# EAGLE design sphere_robo (EAGLE 8.2.2)
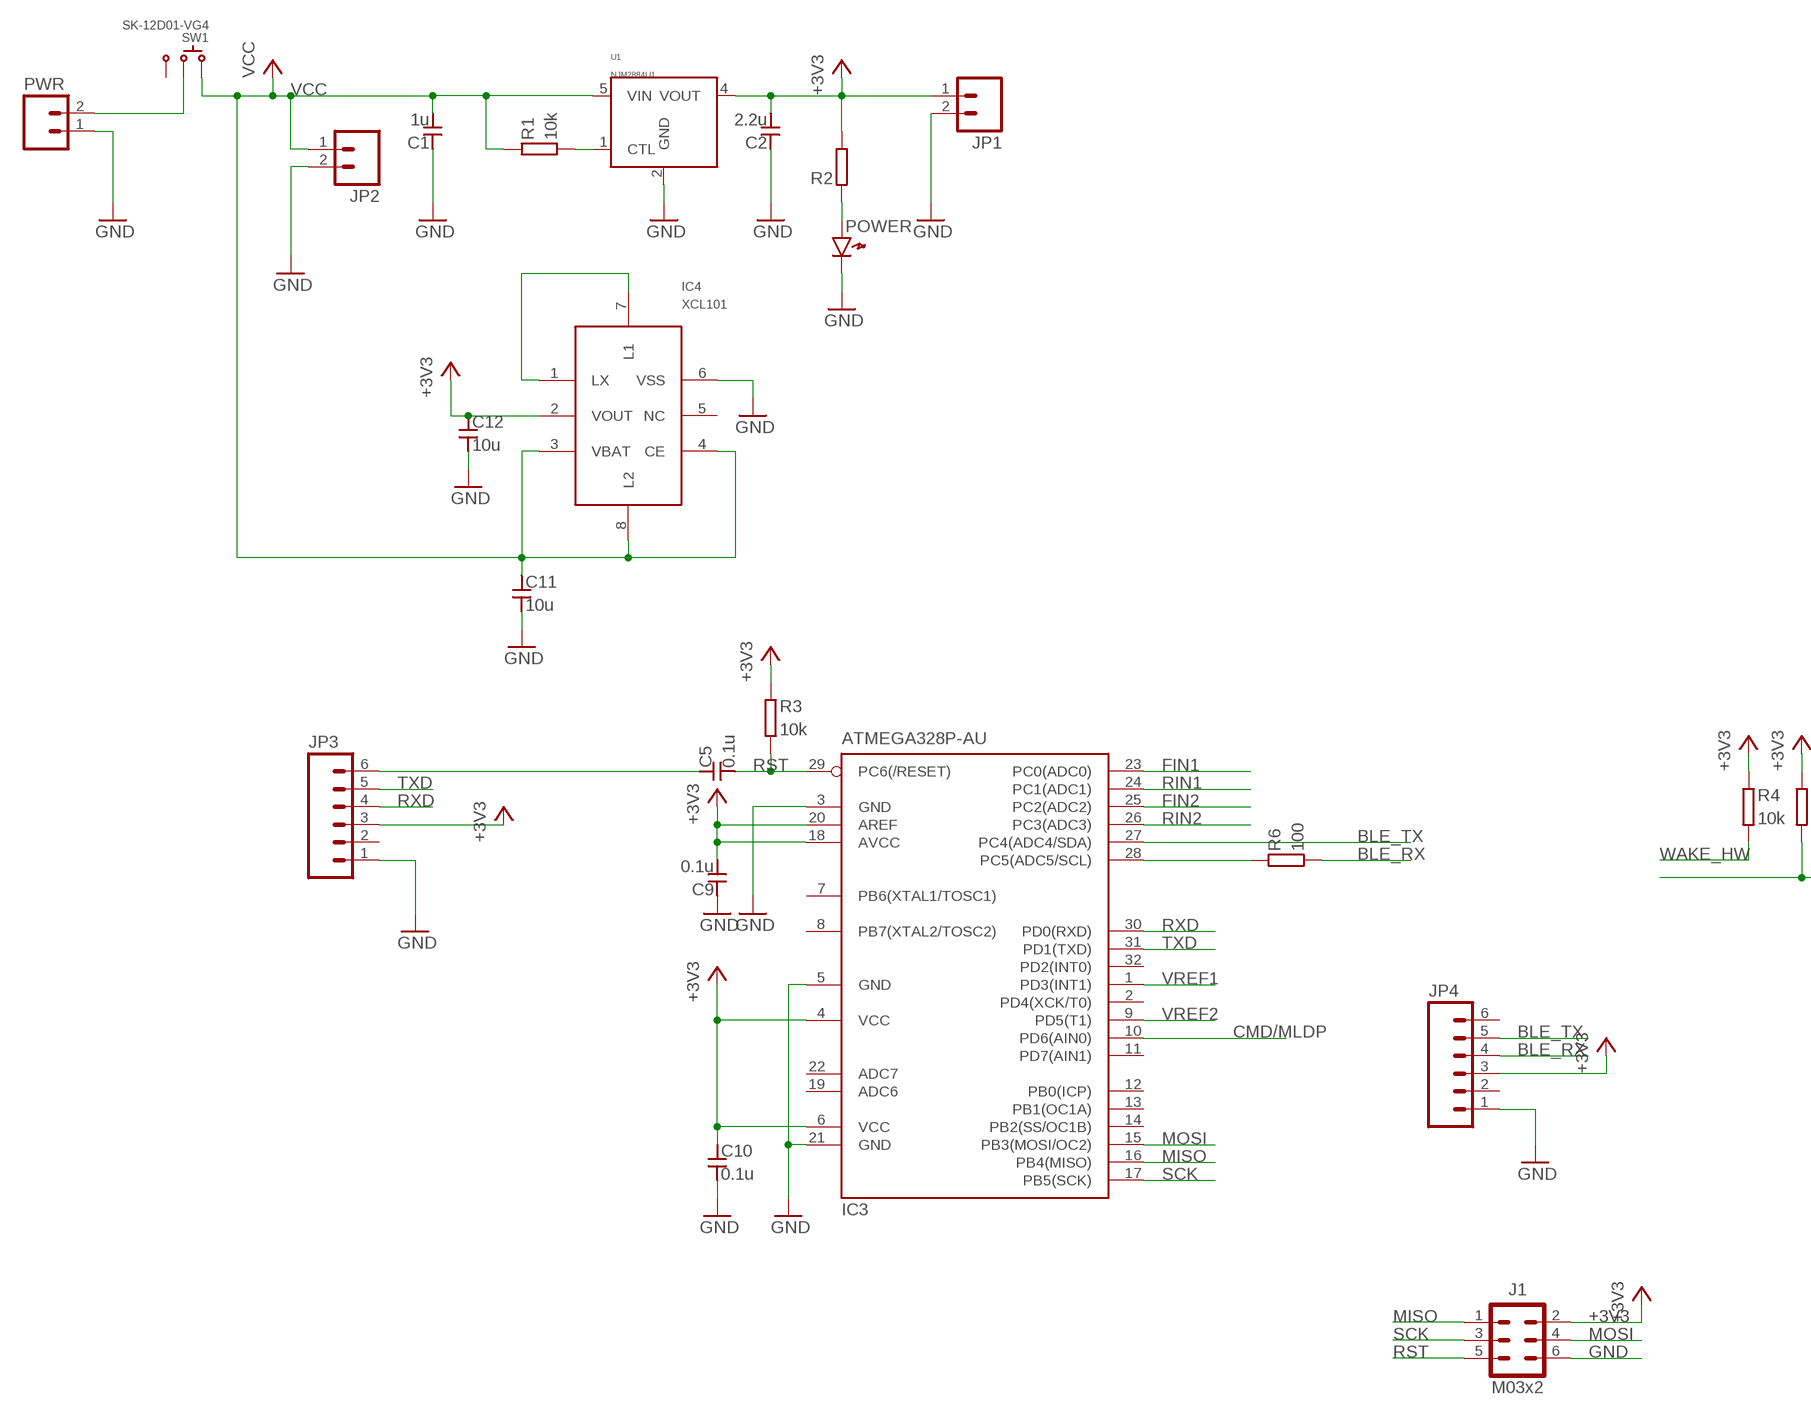
[diagram p0: schematic, sheet 1, part 1 of 2]
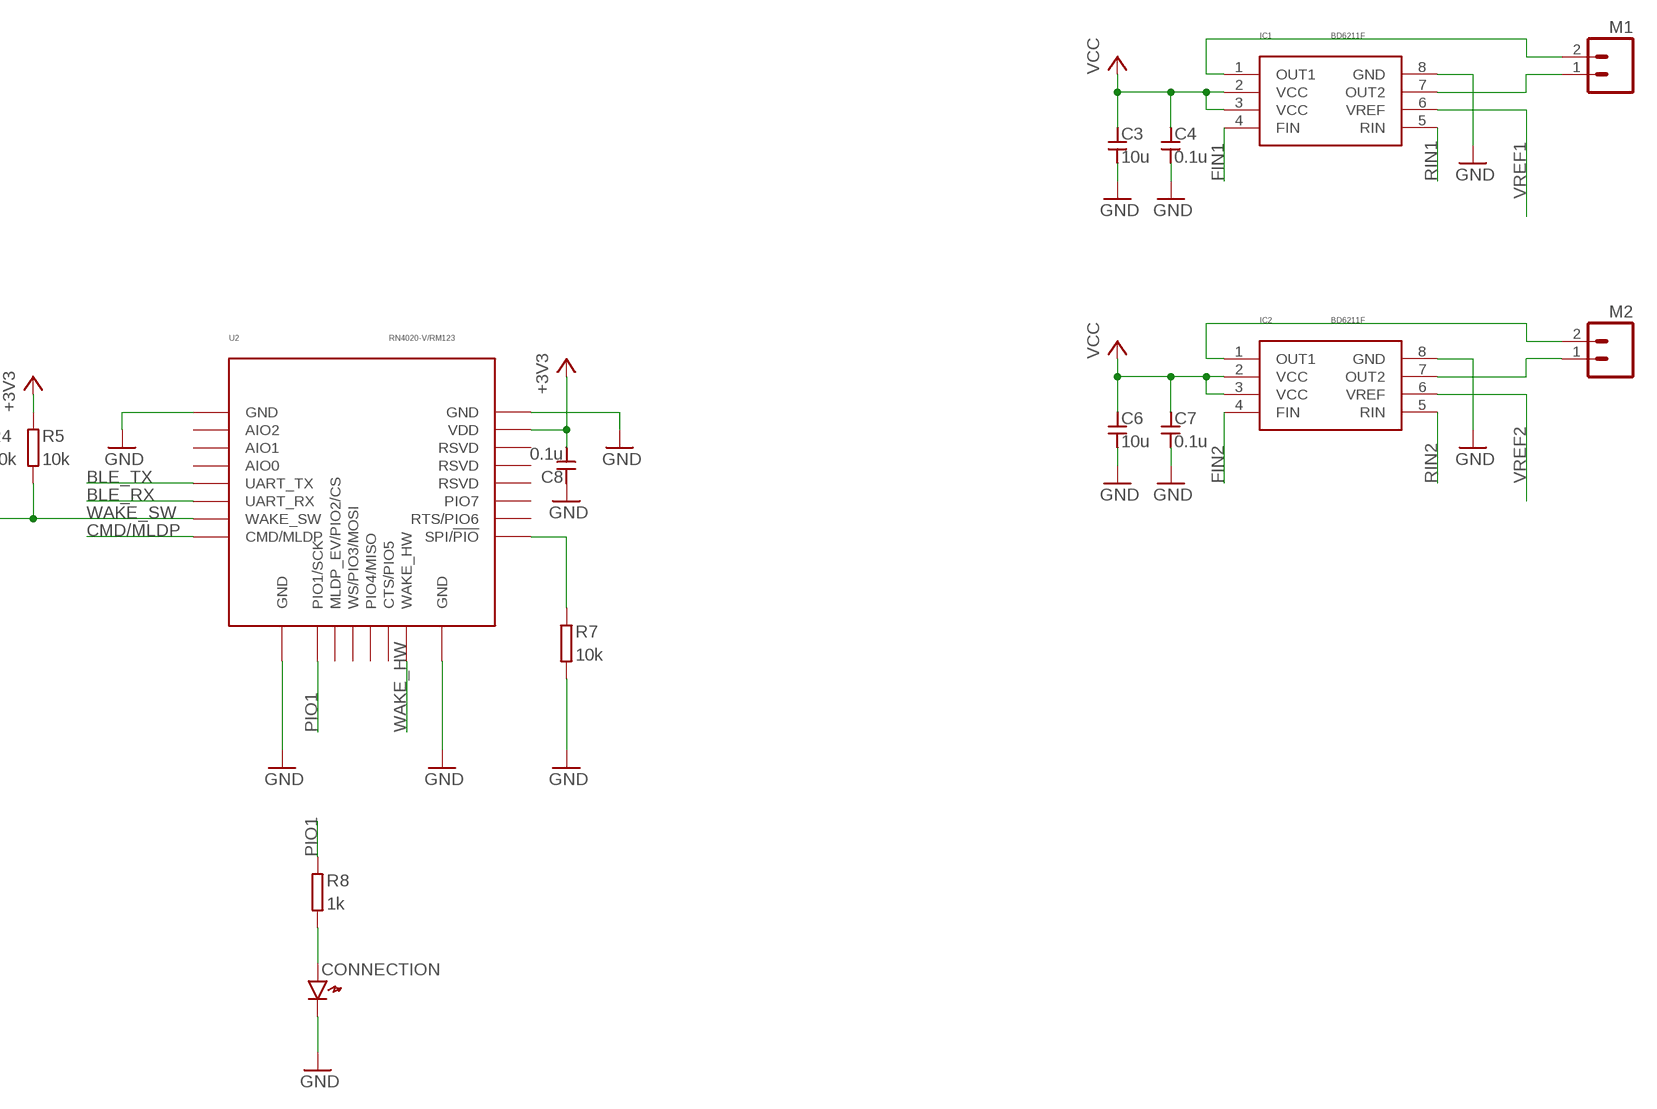
[diagram p1: schematic, sheet 1, part 2 of 2]

## Parts
C1  1u  CAPACITOR1608_REDUCED  [SMD1608_REDUCED]
C2  2.2u  CAPACITOR1608_REDUCED  [SMD1608_REDUCED]
C3  10u  CAPACITOR2012_REDUCED  [SMD2012_REDUCED]
C4  0.1u  CAPACITOR1608_REDUCED  [SMD1608_REDUCED]
C5  0.1u  CAPACITOR1608_REDUCED  [SMD1608_REDUCED]
C6  10u  CAPACITOR2012_REDUCED  [SMD2012_REDUCED]
C7  0.1u  CAPACITOR1608_REDUCED  [SMD1608_REDUCED]
C8  0.1u  CAPACITOR1608_REDUCED  [SMD1608_REDUCED]
C9  0.1u  CAPACITOR1608_REDUCED  [SMD1608_REDUCED]
C10  0.1u  CAPACITOR1608_REDUCED  [SMD1608_REDUCED]
C11  10u  CAPACITOR2012_REDUCED  [SMD2012_REDUCED]
C12  10u  CAPACITOR2012_REDUCED  [SMD2012_REDUCED]
CONNECTION  LED1608_REDUCED  [LED1608_REDUCED]
IC1  BD6211F  [SOP-8]
IC2  BD6211F  [SOP-8]
IC3  ATMEGA328P-AU  [TQFP32-08]
IC4  XCL101  [CL-2025]
J1  M03X2STD  [2X03]
JP1  M02NOSILK  [1X02-NOSILK]
JP2  M02NOSILK  [1X02-NOSILK]
JP3  M06NOSILK  [1X06-NOSILK]
JP4  M06NOSILK  [1X06-NOSILK]
M1  M02NOSILK  [1X02-NOSILK]
M2  M02NOSILK  [1X02-NOSILK]
POWER  LED1608_REDUCED  [LED1608_REDUCED]
PWR  M02NOSILK  [1X02-NOSILK]
R1  10k  RESISTOR1608_REDUCED  [SMD1608_REDUCED]
R2  RESISTOR1608_REDUCED  [SMD1608_REDUCED]
R3  10k  RESISTOR1608_REDUCED  [SMD1608_REDUCED]
R4  10k  RESISTOR1608_REDUCED  [SMD1608_REDUCED]
R5  10k  RESISTOR1608_REDUCED  [SMD1608_REDUCED]
R6  100  RESISTOR1608_REDUCED  [SMD1608_REDUCED]
R7  10k  RESISTOR1608_REDUCED  [SMD1608_REDUCED]
R8  1k  RESISTOR1608_REDUCED  [SMD1608_REDUCED]
SW1  SK-12D01-VG4  [SK-12D01-VG4]
U1  NJM2884U1  [SOT-89-5]
U2  RN4020-V/RM123  [RN4020]

## Nets
+3V3: C2.2 C8.2 C9.2 C10.1 C12.1 IC3.4(VCC) IC3.6(VCC) IC3.18(AVCC) IC3.20(AREF) IC4.2(VOUT) J1.2 JP1.1 JP3.3 JP4.3 R2.2 R3.1 R4.1 R5.1 U1.4(VOUT) U2.23(VDD)
BLE_RX: JP4.4 R6.2 U2.6(UART_RX)
BLE_TX: IC3.27(PC4(ADC4/SDA)) JP4.5 U2.5(UART_TX)
CMD/MLDP: IC3.10(PD6(AIN0)) U2.8(CMD/MLDP)
FIN1: IC1.4(FIN) IC3.23(PC0(ADC0))
FIN2: IC2.4(FIN) IC3.25(PC2(ADC2))
GND: C1.1 C2.1 C3.2 C4.2 C6.2 C7.2 C8.1 C9.1 C10.2 C11.2 C12.2 CONNECTION.K IC1.8(GND) IC2.8(GND) IC3.3(GND) IC3.5(GND) IC3.21(GND) IC4.6(VSS) J1.6 JP1.2 JP2.2 JP3.1 JP4.1 POWER.K PWR.1 R7.2 U1.2(GND) U2.1(GND) U2.9(GND) U2.16(GND) U2.24(GND)
MISO: IC3.16(PB4(MISO)) J1.1
MOSI: IC3.15(PB3(MOSI/OC2)) J1.4
N$2: C5.1 JP3.6
N$3: CONNECTION.A R8.2
N$7: IC3.28(PC5(ADC5/SCL)) R6.1
N$11: R7.1 U2.17(SPI/!PIO)
N$13: PWR.2 SW1.2
N$18: R1.2 U1.1(CTL)
N$20: IC4.1(LX) IC4.7(L1)
N$31: POWER.A R2.1
N$37: IC2.1(OUT1) M2.2
N$38: IC2.7(OUT2) M2.1
N$39: IC1.1(OUT1) M1.2
N$40: IC1.7(OUT2) M1.1
PIO1: R8.1 U2.10(PIO1/SCK)
RIN1: IC1.5(RIN) IC3.24(PC1(ADC1))
RIN2: IC2.5(RIN) IC3.26(PC3(ADC3))
RST: C5.2 IC3.29(PC6(/RESET)) J1.5 R3.2
RXD: IC3.30(PD0(RXD)) JP3.4
SCK: IC3.17(PB5(SCK)) J1.3
TXD: IC3.31(PD1(TXD)) JP3.5
VCC: C1.2 C3.1 C4.1 C6.1 C7.1 C11.1 IC1.2(VCC) IC1.3(VCC) IC2.2(VCC) IC2.3(VCC) IC4.3(VBAT) IC4.4(CE) IC4.8(L2) JP2.1 R1.1 SW1.1 U1.5(VIN)
VREF1: IC1.6(VREF) IC3.1(PD3(INT1))
VREF2: IC2.6(VREF) IC3.9(PD5(T1))
WAKE_HW: R4.2 U2.15(WAKE_HW)
WAKE_SW: R5.2 U2.7(WAKE_SW)
Unconnected: IC3.2(PD4(XCK/T0)) IC3.7(PB6(XTAL1/TOSC1)) IC3.8(PB7(XTAL2/TOSC2)) IC3.11(PD7(AIN1)) IC3.12(PB0(ICP)) IC3.13(PB1(OC1A)) IC3.14(PB2(SS/OC1B)) IC3.19(ADC6) IC3.22(ADC7) IC3.32(PD2(INT0)) IC4.5(NC) JP3.2 JP4.2 JP4.6 SW1.3 U2.2(AIO2) U2.3(AIO1) U2.4(AIO0) U2.11(MLDP_EV/PIO2/CS) U2.12(WS/PIO3/MOSI) U2.13(PIO4/MISO) U2.14(CTS/PIO5) U2.18(RTS/PIO6) U2.19(PIO7) U2.20(RSVD) U2.21(RSVD) U2.22(RSVD)

## Library data of the parts
C1-C12 = generic:CAPACITOR: Generic Capacitor
CONNECTION POWER = generic:LED: Generic LEDs
IC1 IC2 = motor_driver:BD6211: ROHM Motor driver
IC3 = AVR:ATMEGA328P-AU: AVR ATMEGA328P-AU AKIZUKI CODE I-04386
IC4 = DCDC:XCL101
J1 = header:M03X2
JP1 JP2 M1 M2 PWR = header:M02
JP3 JP4 = header:M06
R1-R8 = generic:RESISTOR: Generic Registor
SW1 = switch:SK-12D01-VG4: Slide switch ON-(ON) akizuki: P-08789
U1 = LDO:NJM2884U1: JRC LDO Io(max ) = 500mA akizuki : I-10896
U2 = com_module:RN4020: Bluetooth Low Energy Module Microchip

## Board
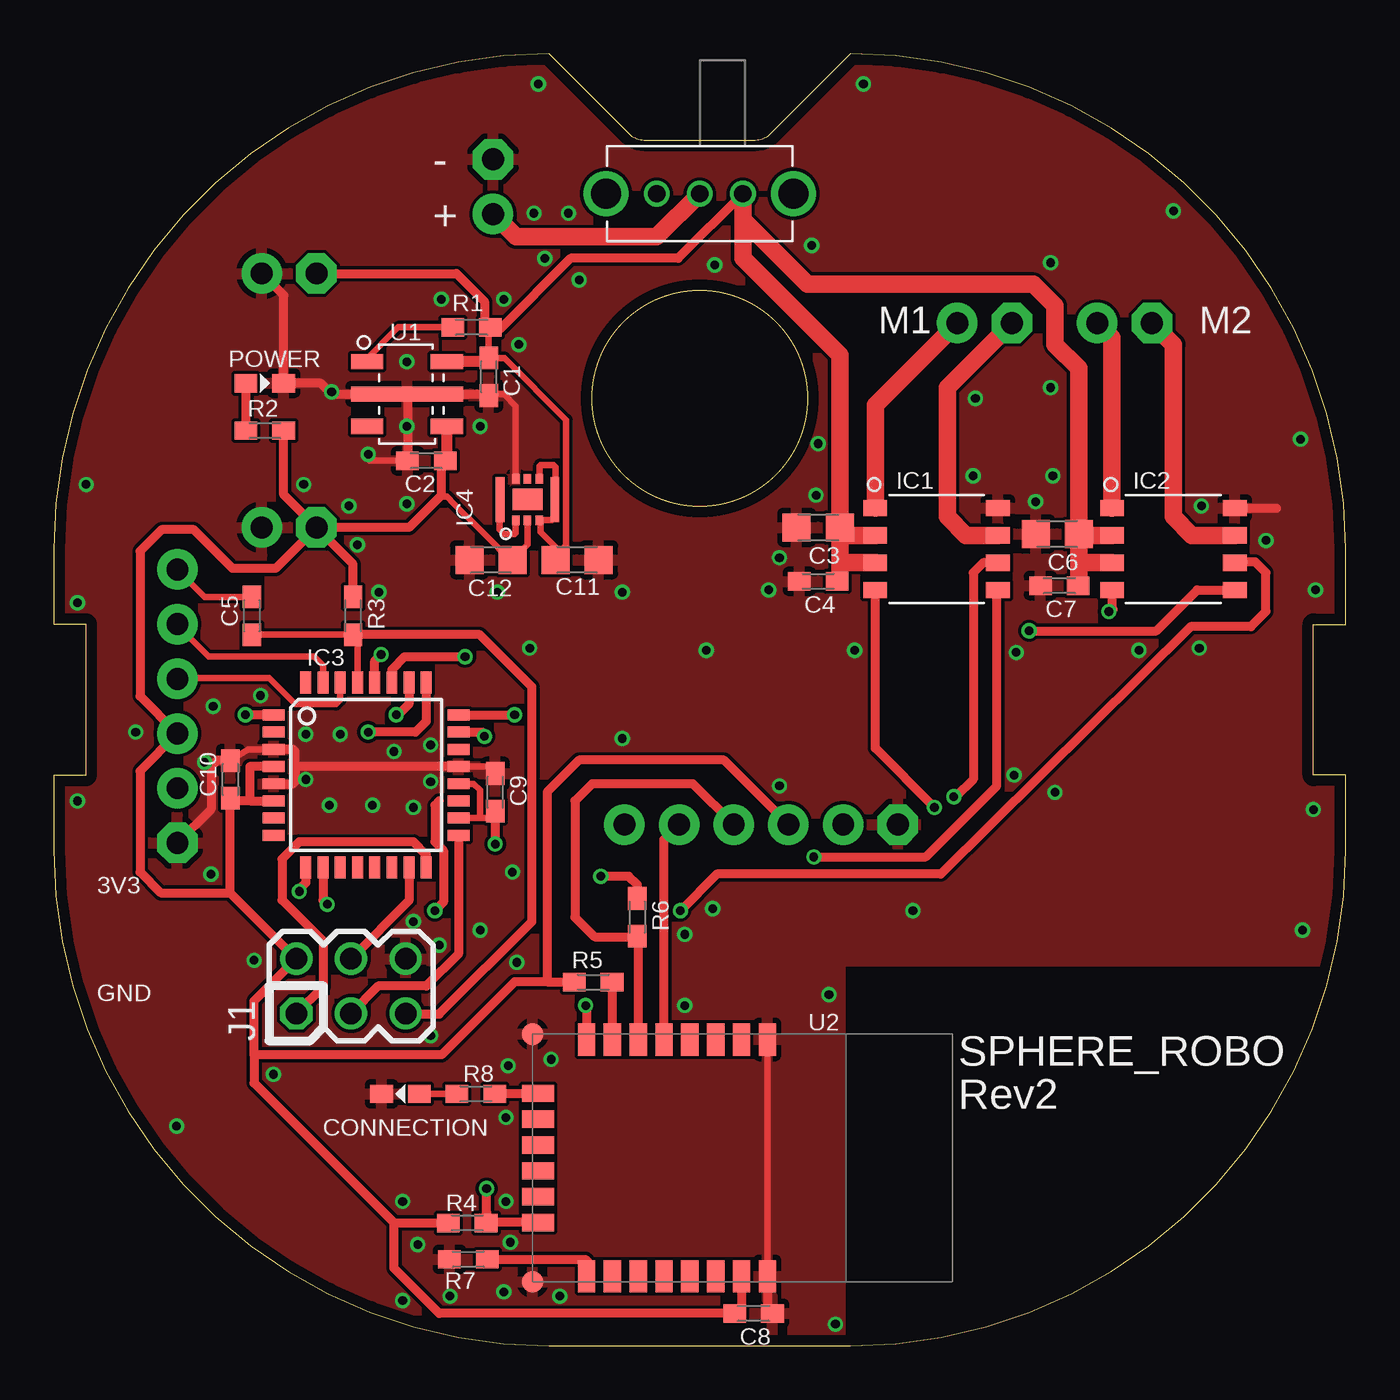
[diagram p2: board, top side]
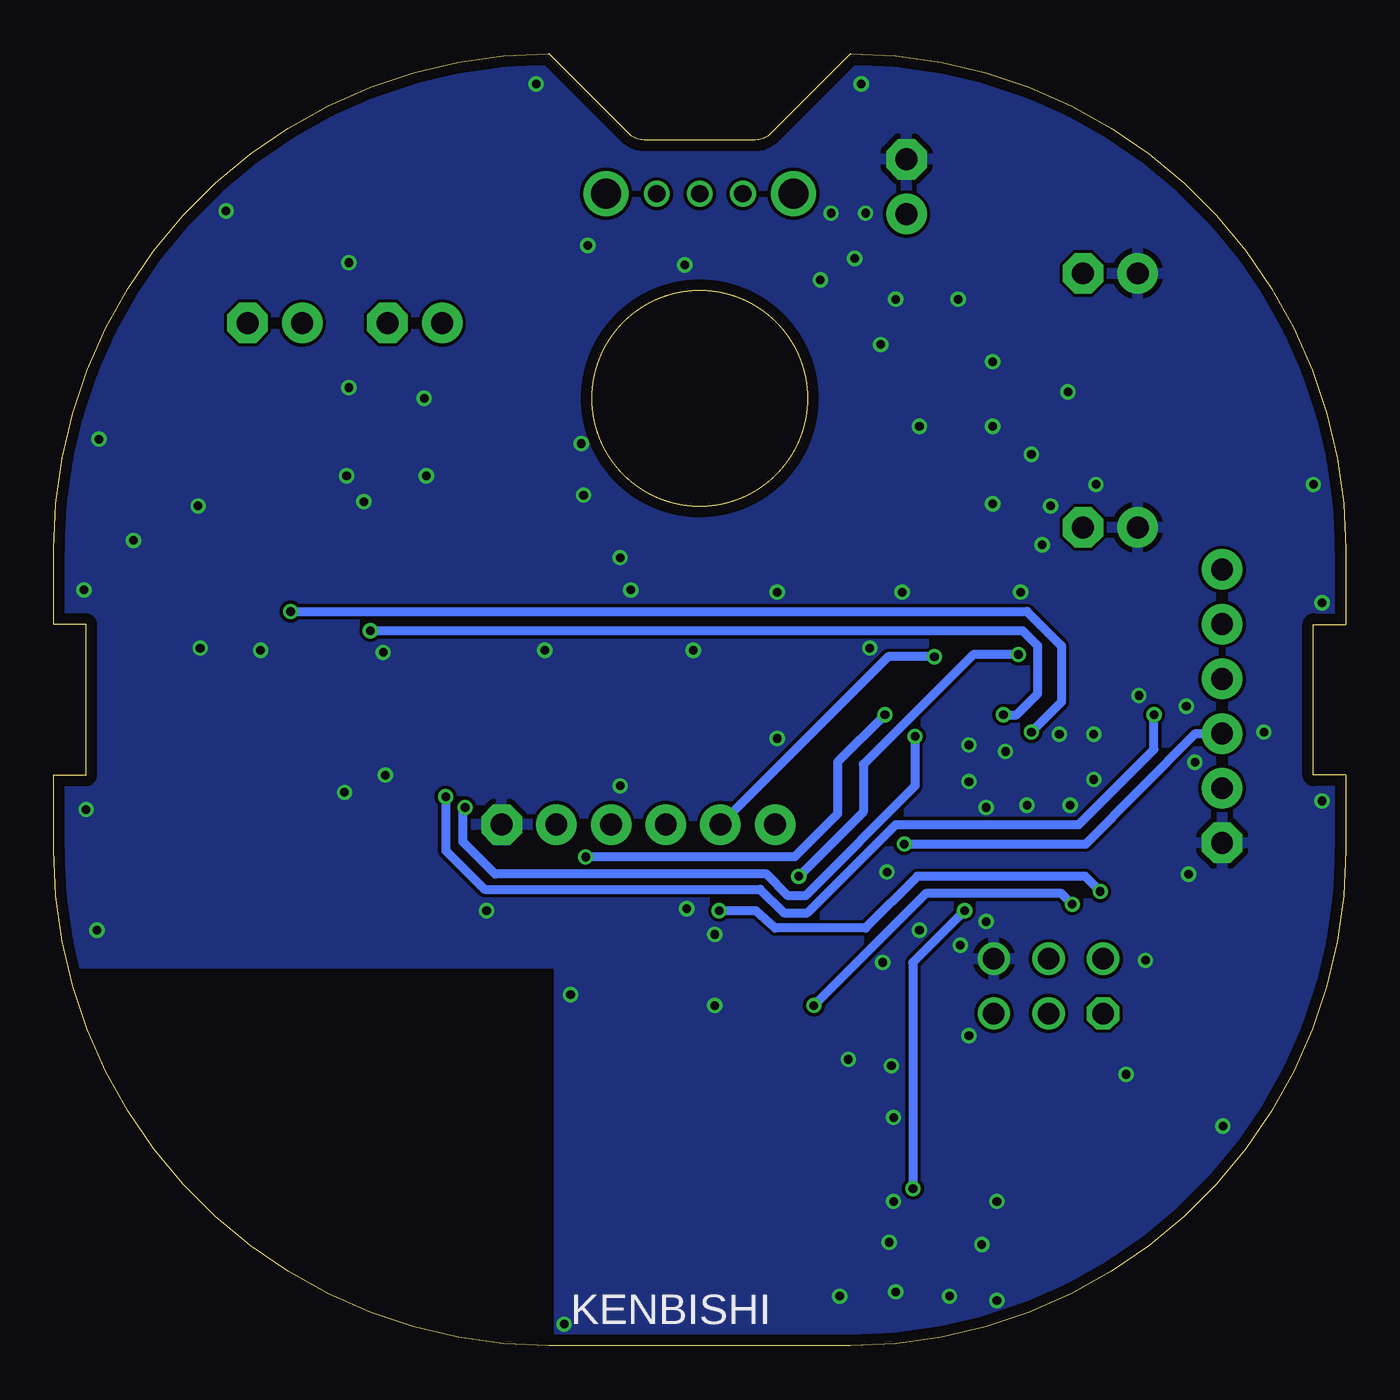
[diagram p3: board, bottom side, seen from below]

Size 60 x 60 mm. Coordinates in mm from the lower left corner, seen from the top.
Outline: 0,26.5 0,23 arc90 23,0 37,0 arc90 60,23 60,26.5 58.5,26.5 58.5,33.5 60,33.5 60,37 arc90 37,60 33.29,56.29 arc-45 32.59,56 27.41,56 arc-45 26.71,56.29 23,60 arc90 0,37 0,33.5 1.5,33.5 1.5,26.5 0,26.5
Outline: circle at 30,44 radius 5
Copper layers (1*16): Top 0.035mm / dielectric 1.6mm / Bottom 0.035mm
Design rules "Elecrow_2-layer_PCB_eagle_rule": minimum track width 6mil, minimum drill 12mil, track to track 6mil, track to pad 6mil, pad to pad 6mil, via to via 8mil, smd to smd 0mil, copper to edge 20mil, drill to drill 10mil, minimum pad ring 6mil, minimum via ring 6mil, stop-mask expansion 0mil, vias tented up to drill 100mil, thermal gap 10mil
tRestrict: area 36.8,0 to 60.8,15.1; area 36.8,14.6 to 60.5,17.6; area 17.9,46.1 to 18,46.8; area 40.3,23.6 to 40.5,24.6
bRestrict: area 36.8,0 to 60.7,15.1; area 36.8,14.7 to 60.4,17.5; area 38.9,23 to 39.6,23.2

### Footprints (pad centres in the part's own frame; a part is rotated, then mirrored left to right if it is on the bottom)
SMD1608_REDUCED = smd 1.05 x 0.85: 1 -0.875,0; 2 0.875,0
SMD2012_REDUCED = smd 1.3 x 1.3: 1 -1,0; 2 1,0
LED1608_REDUCED = smd 1.05 x 0.85: A -0.875,0; K 0.875,0
SOP-8 = smd 1.1 x 0.76: 1 -2.85,1.905; 2 -2.85,0.635; 3 -2.85,-0.635; 4 -2.85,-1.905; 5 2.85,-1.905; 6 2.85,-0.635; 7 2.85,0.635; 8 2.85,1.905
TQFP32-08 = smd 1.016 x 0.508: 1 -4.293,2.8; 2 -4.293,2; 3 -4.293,1.2; 4 -4.293,0.4; 5 -4.293,-0.4; 6 -4.293,-1.2; 7 -4.293,-2; 8 -4.293,-2.8; 17 4.293,-2.8; 18 4.293,-2; 19 4.293,-1.2; 20 4.293,-0.4; 21 4.293,0.4; 22 4.293,1.2; 23 4.293,2; 24 4.293,2.8 | smd 0.508 x 1.016: 9 -2.8,-4.293; 10 -2,-4.293; 11 -1.2,-4.293; 12 -0.4,-4.293; 13 0.4,-4.293; 14 1.2,-4.293; 15 2,-4.293; 16 2.8,-4.293; 25 2.8,4.293; 26 2,4.293; 27 1.2,4.293; 28 0.4,4.293; 29 -0.4,4.293; 30 -1.2,4.293; 31 -2,4.293; 32 -2.8,4.293
CL-2025 = smd 0.35 x 0.44: 1 -0.55,-0.96; 2 0,-0.96; 3 0.55,-0.96; 4 0.55,0.96; 5 0,0.96; 6 -0.55,0.96 | smd 0.4 x 2.1: 7 -1.275,0; 8 1.275,0 | smd 1.4 x 1: P$1 0,0
2X03 = drill 1 octagon: 1 -1.27,2.54 | drill 1: 2 1.27,2.54; 3 -1.27,0; 4 1.27,0; 5 -1.27,-2.54; 6 1.27,-2.54
1X02-NOSILK = drill 1.016 pad 1.88 octagon: 1 0,0 | drill 1.016 pad 1.88: 2 2.54,0
1X06-NOSILK = drill 1.016 pad 1.88 octagon: 1 0,0 | drill 1.016 pad 1.88: 2 2.54,0; 3 5.08,0; 4 7.62,0; 5 10.16,0; 6 12.7,0
SK-12D01-VG4 = drill 0.8: 1 -2,0; 2 0,0; 3 2,0 | drill 1.4: 4 4.35,0; 5 -4.35,0
SOT-89-5 = smd 0.7 x 1.5: 1 -1.5,-1.85; 3 1.5,-1.85; 4 1.5,1.85; 5 -1.5,1.85 | smd 0.7 x 5.2: 2 0,0
RN4020 = smd 1.5 x 0.8: 1 0.25,10.9; 2 0.25,9.7; 3 0.25,8.5; 4 0.25,7.3; 5 0.25,6.1; 6 0.25,4.9; 7 0.25,3.7; 8 0.25,2.5; 17 11.25,2.5; 18 11.25,3.7; 19 11.25,4.9; 20 11.25,6.1; 21 11.25,7.3; 22 11.25,8.5; 23 11.25,9.7; 24 11.25,10.9 | smd 1 x 1: 9 0,0; 16 11.5,0 | smd 0.8 x 1.5: 10 2.75,0.25; 11 3.95,0.25; 12 5.15,0.25; 13 6.35,0.25; 14 7.55,0.25; 15 8.75,0.25

### Placement (x,y rotation side)
C1  20.2,45 90 top
C2  17.3,41.1 0 top
C3  35.5,38 180 top
C4  35.5,35.5 180 top
C5  9.2,33.9 270 top
C6  46.6,37.7 180 top
C7  46.7,35.3 180 top
C8  32.5,1.5 180 top
C9  20.5,25.7 270 top
C10  8.2,26.3 90 top
C11  24.3,36.5 0 top
C12  20.3,36.5 180 top
CONNECTION  16.1,11.7 180 top
IC1  41,37 0 top
IC2  52,37 0 top
IC3  14.5,26.5 0 top
IC4  22,39.3 0 top
J1  13.8,16.7 90 top
JP1  12.2,38 180 top
JP2  12.2,49.8 180 top
JP3  5.74,23.35 90 top
JP4  39.2,24.2 180 top
M1  44.5,47.5 180 top
M2  51,47.5 180 top
POWER  9.8,44.7 0 top
PWR  20.4,55.1 270 top
R1  19.4,47.3 180 top
R2  9.8,42.5 0 top
R3  13.9,33.9 270 top
R4  19.2,5.7 0 top
R5  25.05,16.88 0 top
R6  27.1,19.9 270 top
R7  19.25,4.01 180 top
R8  19.6,11.7 180 top
SW1  30,53.5 180 top
U1  16.4,44.2 270 top
U2  22.24,14.47 270 top

### Tracks (layer width: path | path; a pad name or v marks a point on that pad's centre or on a via)
+3V3  (via drill 0.4)
  Top 0.305: 19.79,24.5 20.27,24.5 20.48,24.71 | 19.79,24.5 IC3.18 | 20.48,24.71 C9.2 20.5,25.1 20.48,24.71 | IC3.20 19.5,26.1 19.79,25.81 19.79,24.5 | IC4.2 22,37.2 C12.1 21.2,36.5 20.1,37.6 19.79,37.9 18.6,39.1 18.26,39.44 17.94,39.44
  Top 0.406: 18.25,41.17 C2.2 18,40.92 18,39.5 17.94,39.44 16.5,38 JP1.1 | 8.2,21.03 J1.2 9.3,16.01 9.3,13.51 | 8.2,21.03 C10.1 8.62,25.3 9.13,25.3 | 9.13,25.3 IC3.6 | IC3.4 9.1,26.9 9.1,25.47 9.13,25.3 | C9.2 v20.5,23.3 | JP1.1 10.68,39.52 R2.2 | 15.85,5.7 R4.1 | 15.85,5.7 15.8,5.7 9.3,12.2 9.3,13.51 | U2.23 31.94,1.81 C8.2 17.9,1.5 15.8,3.6 15.8,5.65 15.85,5.7 | R5.1 24.16,16.9 22.91,16.9 | 22.91,16.9 21.4,16.9 18.01,13.51 9.3,13.51 | JP4.3 31.12,27.2 24.4,27.2 22.91,25.71 22.91,16.9 | R3.1 13.9,36.3 JP1.1 | JP1.1 10.3,36.1 8.3,36.1 6.5,37.9 5,37.9 4,36.9 4,30.17 JP3.3 4,26.69 4,22 4.97,21.03 8.2,21.03
  Top 0.508: U1.4 18.25,41.17
  Bottom 0.406: v20.5,23.3 12.07,23.3 7,28.4 6.97,28.43 JP3.3
BLE_RX
  Top 0.406: 27.14,18.98 U2.6 | 27.14,18.98 R6.2 | JP4.4 29.68,26.1 25,26.1 24.2,25.3 24.2,19.9 25.11,18.98 27.14,18.98
BLE_TX  (via drill 0.4)
  Top 0.406: U2.5 28.34,23.5 JP4.5 | IC3.27 15.7,31.4 16.3,32 v19.1,32
  Bottom 0.406: v19.1,32 21.24,32 JP4.5
CMD/MLDP  (via drill 0.4)
  Top 0.406: IC3.10 12.5,20.7 v12.7,20.5 | v24.7,15.8 24.74,15.76 U2.8
  Bottom 0.406: v12.7,20.5 13.2,21 19.5,21 v24.7,15.8 | v24.7,15.8 24.7,15.7 v24.7,15.8
FIN1  (via drill 0.4)
  Top 0.406: IC3.23 19.9,28.5 20,28.4 v20,28.3 | v40.9,25 38.15,27.75 IC1.4
  Bottom 0.406: v20,28.3 20,26 25.1,20.9 25.9,20.9 26.9,21.9 39.5,21.9 41,23.4 41,24.8 40.9,24.9 v40.9,25
FIN2  (via drill 0.4)
  Top 0.406: IC3.25 17.3,29 16.8,28.5 v14.6,28.5 | IC2.4 49.15,34.25 49.2,34.2 49.1,34.2 v49,34.1
  Bottom 0.406: v49,34.1 14.8,34.1 13.2,32.5 13.2,29.9 v14.6,28.5
GND  (via drill 0.4)
  Top 0.305: C2.1 14.68,41.1 | IC3.21 20.36,26.9 C9.1 | 19.6,44.15 19.65,44.2 | CONNECTION.K 15.22,11.85 | U2.1 U2.24 | IC3.3 9.03,27.7 C10.2 | IC4.6 21.45,43.65 20.9,44.2 20.27,44.2 C1.1
  Top 0.406: U1.2 19.65,44.2 20.12,44.2 C1.1 | U1.2 16.43,44.17 C2.1 16.4,41.08 | U1.2 12.9,44.2 12.4,44.7 POWER.K 10.68,48.78 JP2.2 | U2.24 33.14,1.74 C8.1 | IC3.5 11.1,26.1 11.2,26.2 11.2,26.95 | 11.2,26.95 11.2,27.6 11.1,27.7 IC3.3 | IC3.21 11.25,26.9 11.2,26.95 | C10.2 7.58,27.18 7.3,26.9 7.3,24.91 JP3.1 | IC2.8 56.8,38.9
  other vias: 1.5,40 1.1,34.5 57.9,42.1 58.6,35.1 58,19.3 58.5,24.9 16.2,2.1 5.7,10.2 45.6,39.2 16.9,4.7 20.9,2.5 23.5,2.3 18.4,2.3 1.1,25.3 9.6,30.2 7.4,29.7 7,27.1 11.7,28.4 11.7,26.3 12.8,25.1 16.7,25 14.8,25.1 17.5,27.9 17.5,26.2 15.8,27.6 13.3,28.4 7.3,21.9 3.8,28.5 14.1,37.2 15.1,35 16.4,39.1 13.7,39 11.6,40 20.9,48.6 22.8,50.5 22.3,52.6 30.7,50.2 35.5,41.9 35.4,39.5 33.7,36.6 46.3,44.5 42.8,44 42.7,40.4 46.4,40.4 53.3,39 37.6,58.6 22.5,58.6 35.2,51.1 23.9,52.6 50.4,32.3 44.6,26.5 44.7,32.2 53.2,32.4 56.3,37.4 36,16.3 29.3,15.8 29.3,19.1 30.6,20.3 39.9,20.2 46.5,25.7 33.7,26 26.4,28.2 22.1,32.4 37.2,32.3 30.3,32.3 33.2,35.1 26.4,35 20.6,35 21.6,46.5 24.4,49.5 18,48.6 12.9,44.3 14.6,41.4 16.4,45.7 16.4,42.7 19.8,42.7 36.3,1 21.2,4.8 21,6.7 23.1,13.3 21.1,13 21,10.6 10.2,12.6 9.3,17.9 21.5,17.8 17.5,14.4 16.7,19.7 17.9,18.6 19.8,19.3 21.3,22 16.2,6.7 52,52.7 46.3,50.3
  pour Top: 1,60 0,60 0,0 60,0 60,60
  pour Bottom: 0,60 60,60 60,0 0,0
MISO
  Top 0.406: IC3.16 17.3,22.8 16.7,23.4 11.4,23.4 10.6,22.6 10.6,20.7 12.5,18.8 12.5,16.67 J1.1
MOSI
  Top 0.406: IC3.15 16.5,20.67 J1.4
N$2
  Top 0.305: C5.1 7.01,34.77 JP3.6
N$3
  Top 0.305: CONNECTION.A R8.2
N$7  (via drill 0.4)
  Top 0.406: IC3.28 14.9,31.8 v15.2,32.1 | 27.07,20.8 R6.1 27.1,21.4 26.7,21.8 v25.4,21.8
  Bottom 0.406: v15.2,32.1 17.3,32.1 22.4,27 22.4,24.8 v25.4,21.8
N$11
  Top 0.406: R7.1 24.69,4.01 24.8,3.9 24.8,3.28 U2.17
N$13
  Top 0.813: PWR.2 21.46,51.5 28,51.5 SW1.2
N$18
  Top 0.305: R1.2 16,47.3 14.4,45.7 14.7,45.7 14.62,45.77
  Top 0.406: 14.62,45.77 U1.1
N$20
  Top 0.305: IC4.1 21.45,37.75 21.4,37.7 20.9,37.7 20.7,37.9 20.7,39.27 IC4.7
N$31
  Top 0.406: R2.1 POWER.A
N$37
  Top 0.813: IC2.1 49.15,46.81 M2.2
N$38
  Top 0.813: IC2.7 52.87,37.63 52,38.5 52,46.5 M2.1
N$39
  Top 0.813: IC1.1 38.15,43.69 M1.2
N$40
  Top 0.813: IC1.7 42.37,37.63 41.5,38.5 41.5,44.5 M1.1
PIO1
  Top 0.406: R8.1 20.5,11.72 U2.10
RIN1  (via drill 0.4)
  Top 0.406: IC3.24 v21.4,29.3 | v35.3,22.7 40.5,22.7 43.8,26 43.8,35.05 IC1.5
  Bottom 0.406: v21.4,29.3 23.6,27.1 23.6,24.7 25.6,22.7 v35.3,22.7
RIN2  (via drill 0.4)
  Top 0.406: IC3.26 16.5,29.8 16,29.3 v15.9,29.3 | v45.3,33.2 51.2,33.2 53.1,35.1 IC2.5
  Bottom 0.406: v15.9,29.3 15.3,29.3 14.3,30.3 14.3,32.5 15,33.2 v45.3,33.2
RST
  Top 0.305: R3.2 14.1,32.84 | IC3.29 14.1,32.52 R3.2 | C5.2 R3.2
  Top 0.406: J1.5 16.37,15.4 17.9,15.4 22.2,19.7 22.2,30.6 19.77,33.02 R3.2
RXD
  Top 0.305: IC3.30 13.3,30 13.1,29.8 11.2,29.8 10,31 6.47,31 JP3.4
SCK
  Top 0.406: IC3.17 18.79,18.19 17.3,16.7 15.07,16.7 J1.3
TXD
  Top 0.305: 6.25,33 JP3.5 6.2,33 7.2,32 12.1,32 12.5,31.6 IC3.31
VCC
  Top 0.305: R1.1 20.2,47.23 C1.2 20.93,45.88 23.8,43 23.8,37.2 C11.1 23.3,37.1 22.6,37.8 22.6,38.29 IC4.3 23.14,38.34 23.3,38.5 23.3,39.33 | IC4.4 22.55,40.85 22.6,40.9 23.2,40.9 23.3,40.8 23.3,39.33 | 23.3,39.33 IC4.8
  Top 0.406: 20.27,45.8 C1.2 20.02,45.7 | SW1.1 29,50.5 24,50.5 20.73,47.23 20.2,47.23 | 47.66,37.63 C6.1 | 47.87,36.37 47.5,36 47.5,35.38 C7.1 47.6,35.33 | 36.87,37.63 C3.1 | 36.87,36.37 36.5,36 36.5,35.62 C4.1 | JP2.1 18.7,49.8 20,48.5 20,47.58 R1.1
  Top 0.508: 20.02,45.7 U1.5
  Top 0.813: IC2.2 47.66,37.63 | IC2.3 47.87,36.37 | IC1.2 36.87,37.63 | IC1.3 36.87,36.37 | 36.5,36 C3.1 36.5,46 32,50.5 SW1.1 32,52.3 35,49.3 45.5,49.3 46.5,48.3 46.5,46.5 47.6,45.4 C6.1 47.6,35.33
VREF1  (via drill 0.4)
  Top 0.406: IC1.6 43.16,36.37 42.7,35.9 42.7,26.3 41.9,25.5 v41.8,25.5 | IC3.1 v8.9,29.3
  Bottom 0.406: v41.8,25.5 41.8,23 40,21.2 27.2,21.2 26.1,20.1 25,20.1 20.9,24.2 12.4,24.2 8.9,27.7 v8.9,29.3
VREF2  (via drill 0.4)
  Top 0.406: IC3.9 11.7,21.5 11.3,21.1 v11.4,21.1 | IC2.6 54.88,36.4 55.8,36.4 56.3,35.9 56.3,34.1 55.6,33.4 52.8,33.4 41.2,21.9 30.8,21.9 v29.1,20.2
  Bottom 0.406: v11.4,21.1 12.1,21.8 19.9,21.8 22.3,19.4 26.5,19.4 27.4,20.2 v29.1,20.2
WAKE_HW  (via drill 0.4)
  Top 0.406: 17.9,25.3 17.7,25.1 17.7,23.4 18.1,23 18.1,20.6 v17.7,20.2 | v20.1,7.3 20.1,6.17 R4.2 20.09,5.72 U2.15
  Bottom 0.406: v17.7,20.2 20.1,17.8 v20.1,7.3
WAKE_SW
  Top 0.305: 25.93,13.73 25.93,14.06 U2.7
  Top 0.406: R5.2 25.93,14.07 25.93,14.06

### Text on the board
tPlace: - | + | M1 | M2 | 3V3 | GND | SPHERE_ROBO | Rev2
bPlace: KENBISHI